# Altium schematic sheet MT7688_SOC.SchDoc
size A4
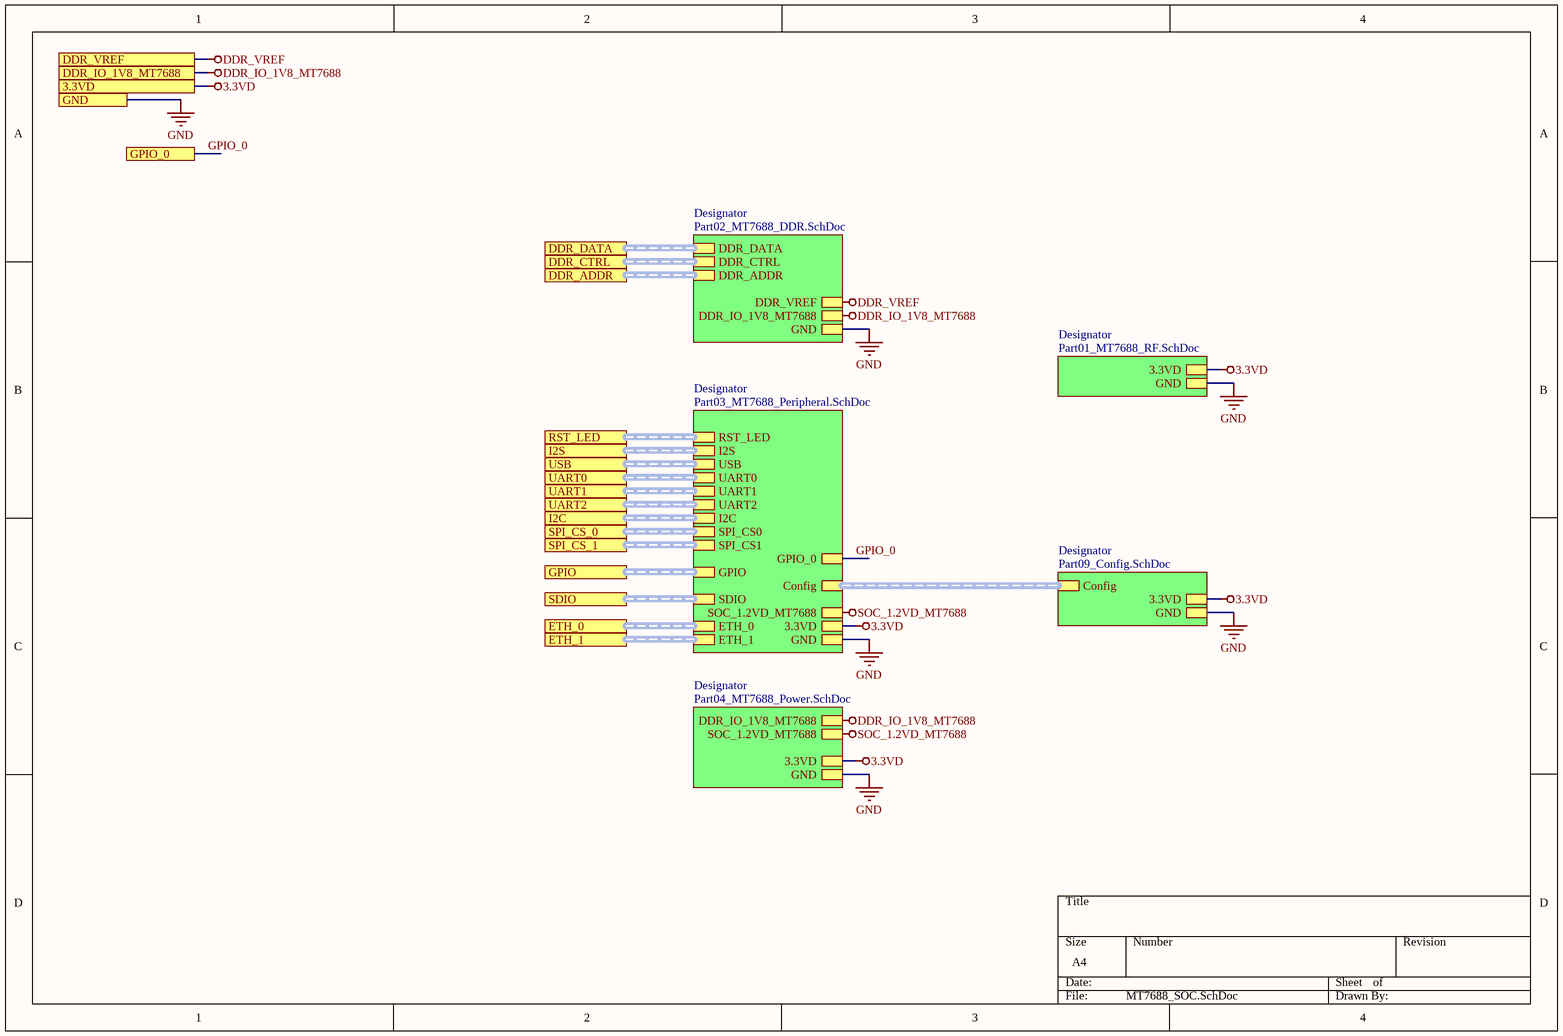
[diagram p0: MT7688_SOC.SchDoc]

## Sub-sheets
Designator = Part03_MT7688_Peripheral.SchDoc: I2S (harness I2S), USB (harness USB), UART1 (harness UART1), ETH_1 (harness ETH_1), UART0 (harness UART0), I2C (harness I2C), GPIO (harness GPIO), ETH_0 (harness ETH_0), UART2 (harness UART2), SDIO (harness SDIO), Config (harness Config), RST_LED (harness RST), SPI_CS0 (harness SPI_CS_0), SPI_CS1 (harness SPI_CS_1), 3.3VD, GND, SOC_1.2VD_MT7688, GPIO_0
Designator = Part04_MT7688_Power.SchDoc: GND, DDR_IO_1V8_MT7688, 3.3VD, SOC_1.2VD_MT7688
Designator = Part01_MT7688_RF.SchDoc: GND, 3.3VD
Designator = Part09_Config.SchDoc: GND, 3.3VD, Config (harness Config)
Designator = Part02_MT7688_DDR.SchDoc: DDR_DATA (harness DDR_DATA), DDR_CTRL (harness DDR_CTRL), DDR_ADDR (harness DDR_ADDR), DDR_VREF, DDR_IO_1V8_MT7688, GND

## Ports
3.3VD, DDR_ADDR, DDR_CTRL, DDR_DATA, DDR_IO_1V8_MT7688, DDR_VREF, ETH_0, ETH_1, GND, GPIO, GPIO_0, I2C, I2S, RST_LED, SDIO, SPI_CS_0, SPI_CS_1, UART0, UART1, UART2, USB

## Nets
3.3VD: port 3.3VD, sheet Designator/3.3VD, sheet Designator/3.3VD, sheet Designator/3.3VD, sheet Designator/3.3VD
DDR_IO_1V8_MT7688: port DDR_IO_1V8_MT7688, sheet Designator/DDR_IO_1V8_MT7688, sheet Designator/DDR_IO_1V8_MT7688
DDR_VREF: port DDR_VREF, sheet Designator/DDR_VREF
GND: port GND, sheet Designator/GND, sheet Designator/GND, sheet Designator/GND, sheet Designator/GND, sheet Designator/GND
SOC_1.2VD_MT7688: sheet Designator/SOC_1.2VD_MT7688, sheet Designator/SOC_1.2VD_MT7688
GPIO_0: port GPIO_0, sheet Designator/GPIO_0

## Buses and harness runs
harness port DDR_ADDR = sheet Designator/DDR_ADDR
harness port DDR_CTRL = sheet Designator/DDR_CTRL
harness port DDR_DATA = sheet Designator/DDR_DATA
harness port ETH_0 = sheet Designator/ETH_0
harness port ETH_1 = sheet Designator/ETH_1
harness port GPIO = sheet Designator/GPIO
harness port I2C = sheet Designator/I2C
harness port I2S = sheet Designator/I2S
harness port RST_LED = sheet Designator/RST_LED
harness port SDIO = sheet Designator/SDIO
harness port SPI_CS_0 = sheet Designator/SPI_CS0
harness port SPI_CS_1 = sheet Designator/SPI_CS1
harness port UART0 = sheet Designator/UART0
harness port UART1 = sheet Designator/UART1
harness port UART2 = sheet Designator/UART2
harness port USB = sheet Designator/USB